# EAGLE schematic LED (EAGLE 9.5.2)
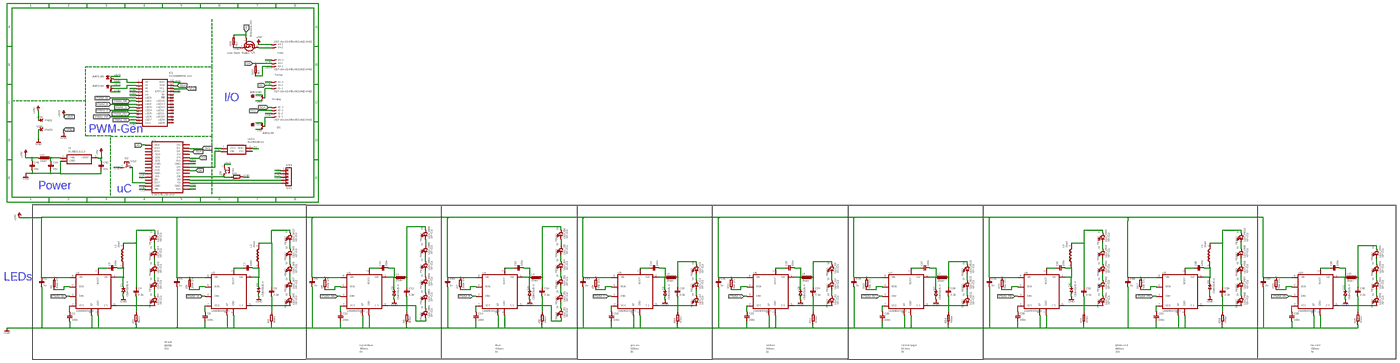
[diagram p0: schematic, sheet 1, overview]
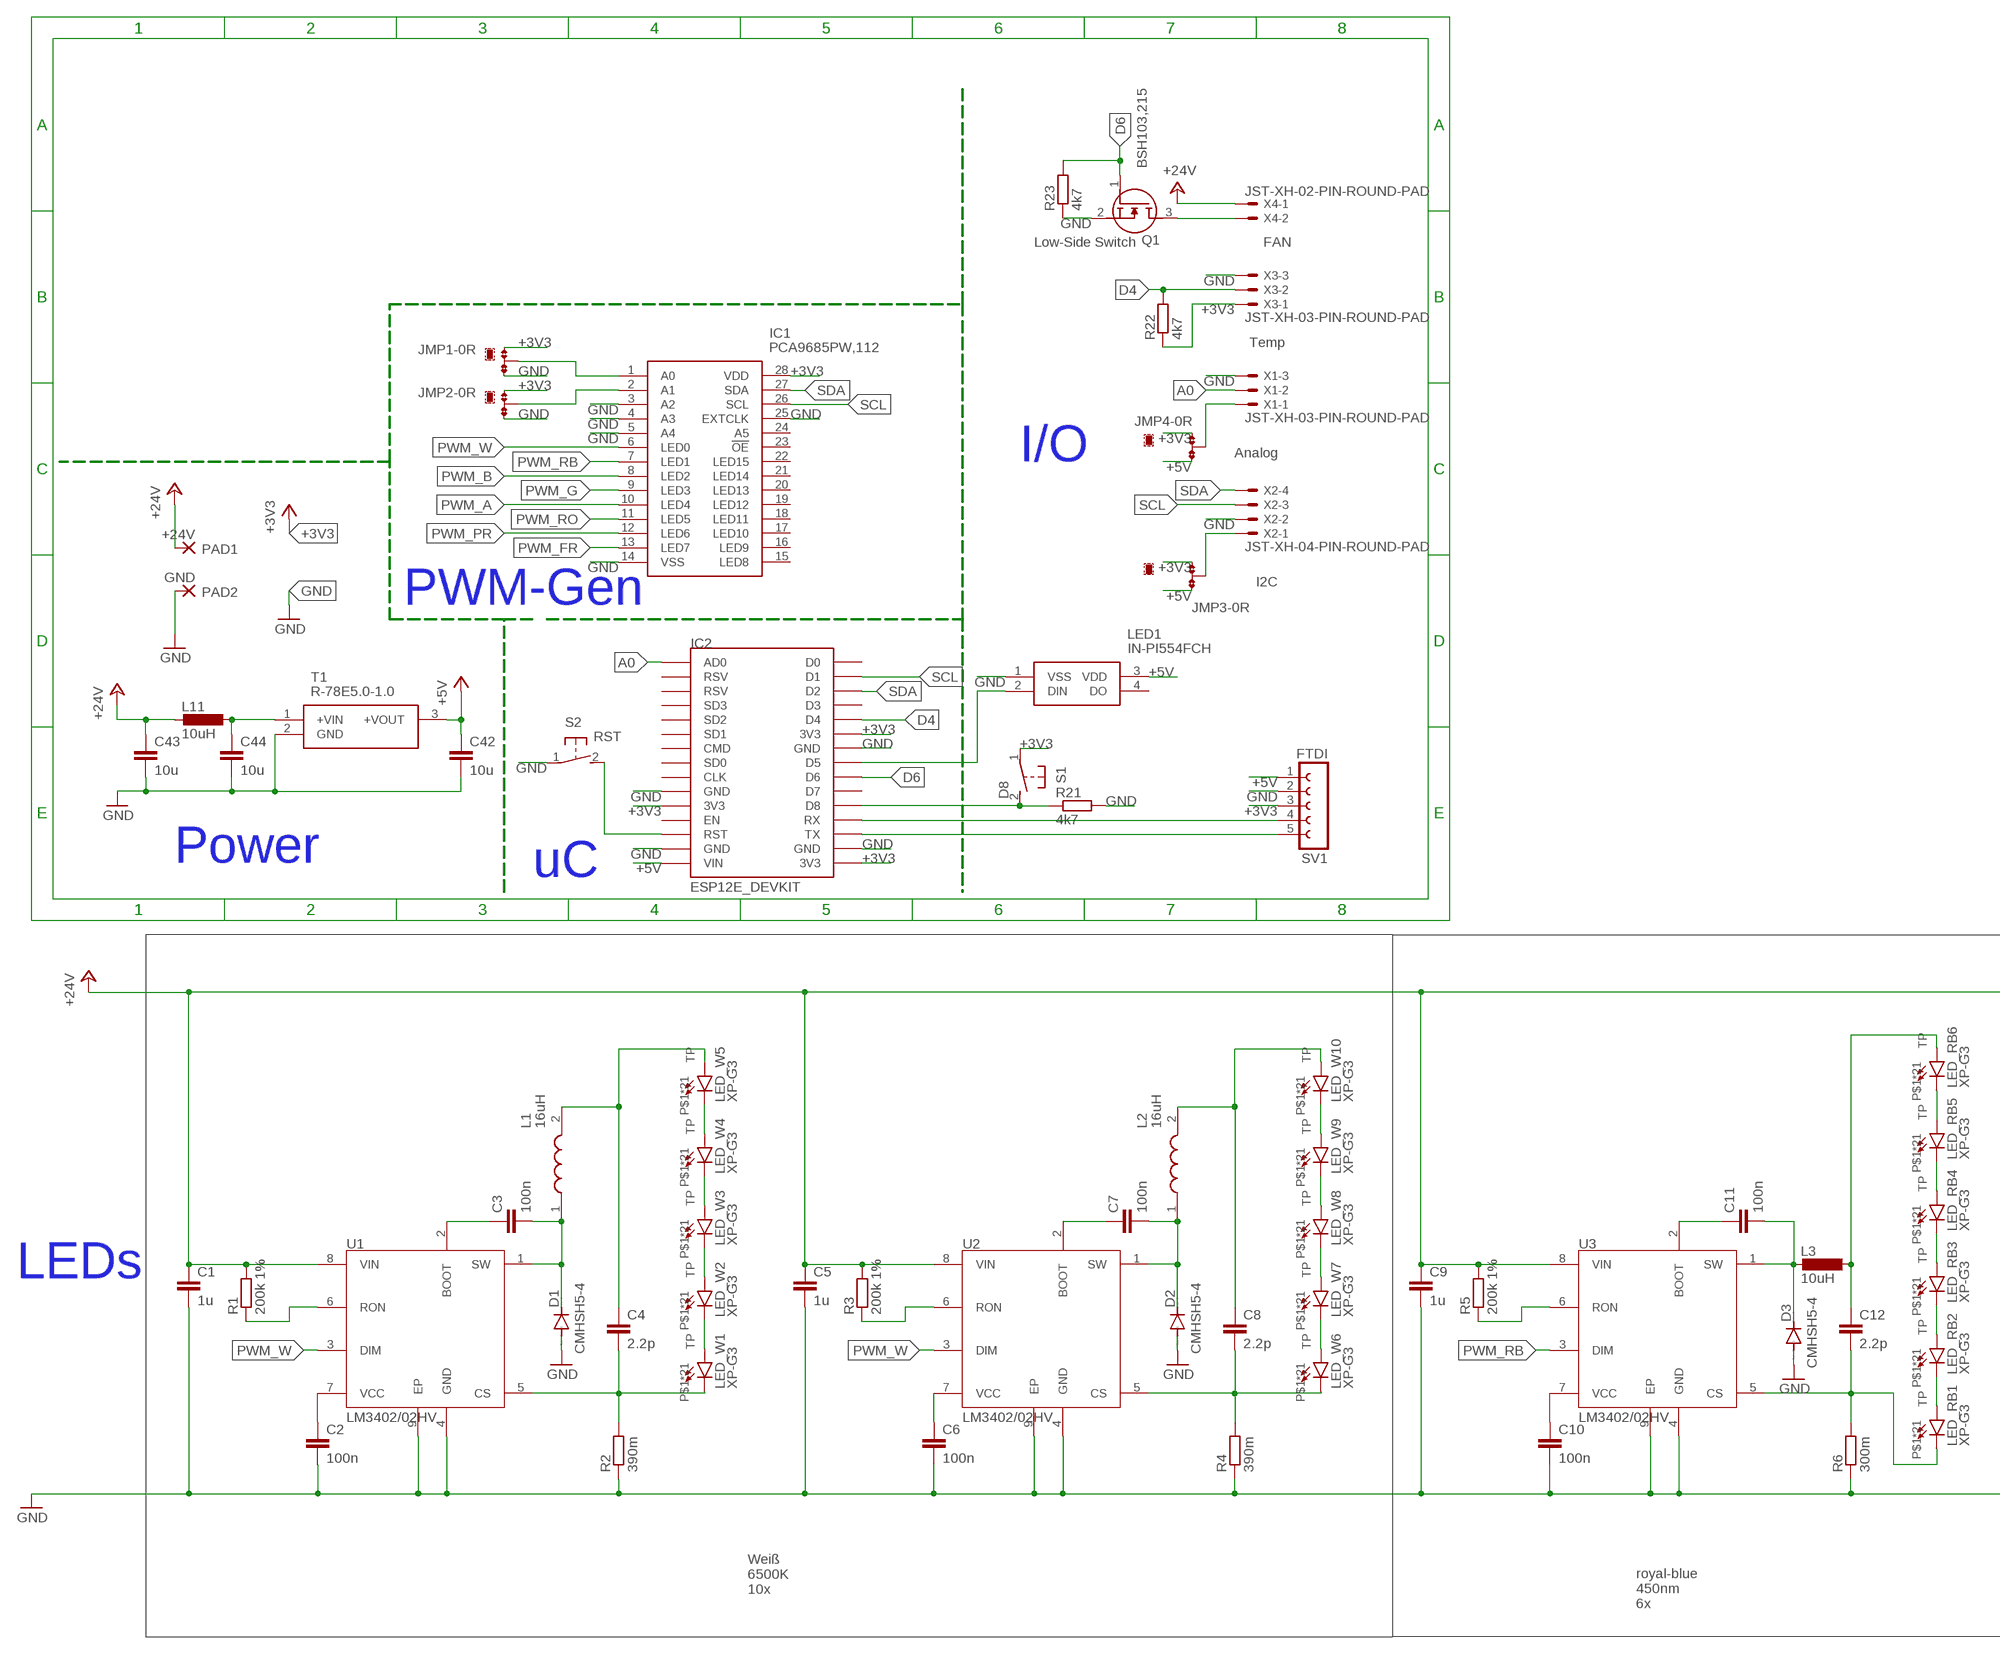
[diagram p1: schematic, sheet 1, part 1 of 4]
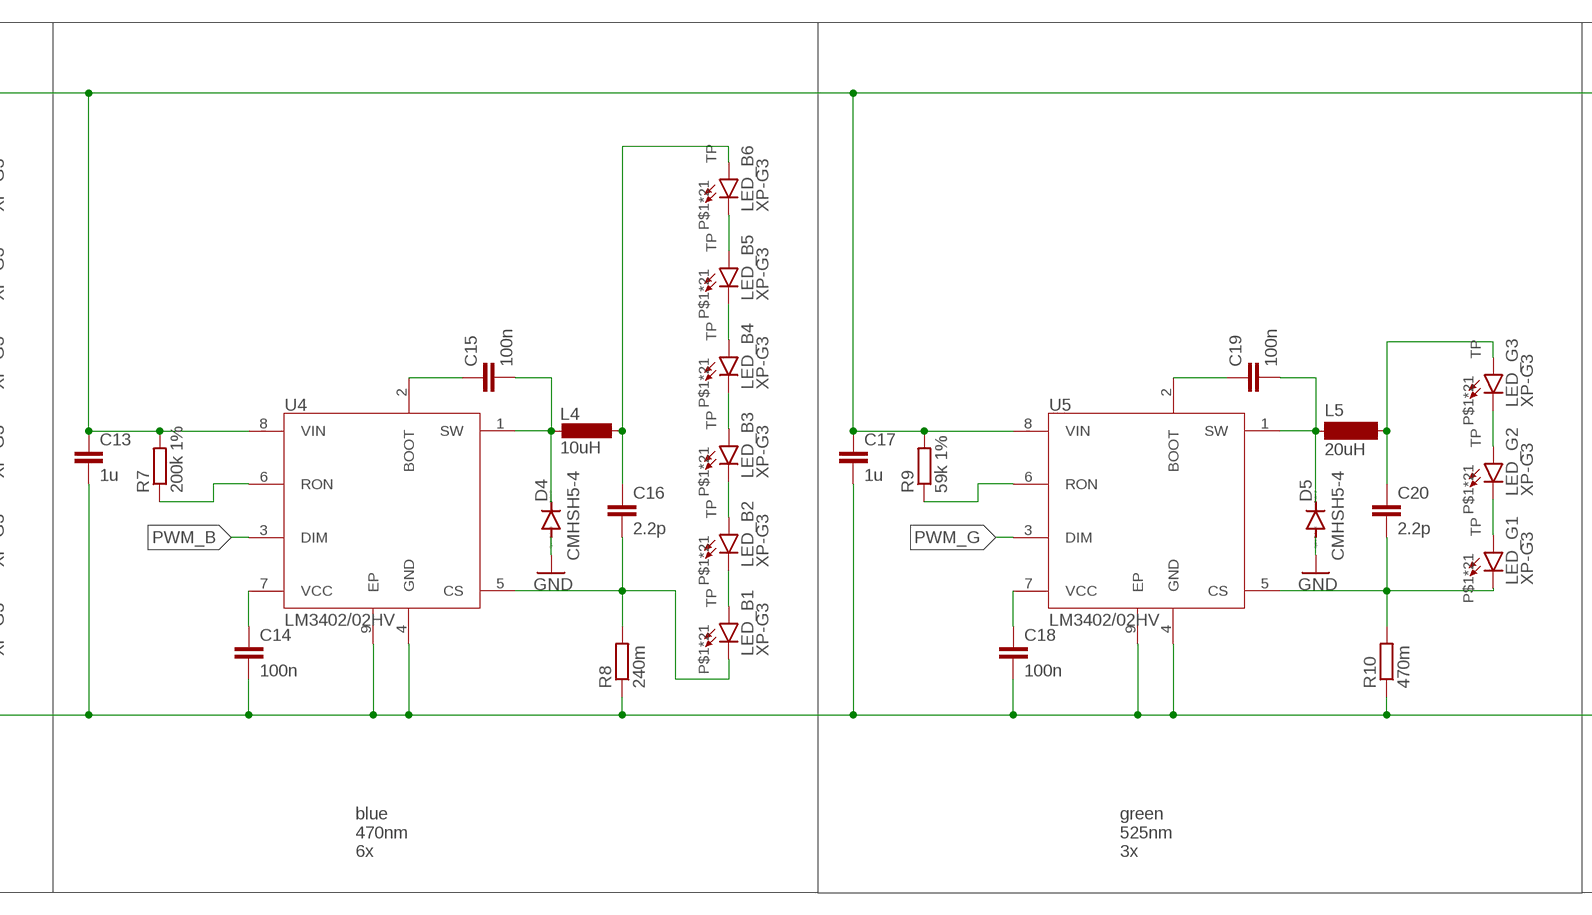
[diagram p2: schematic, sheet 1, part 2 of 4]
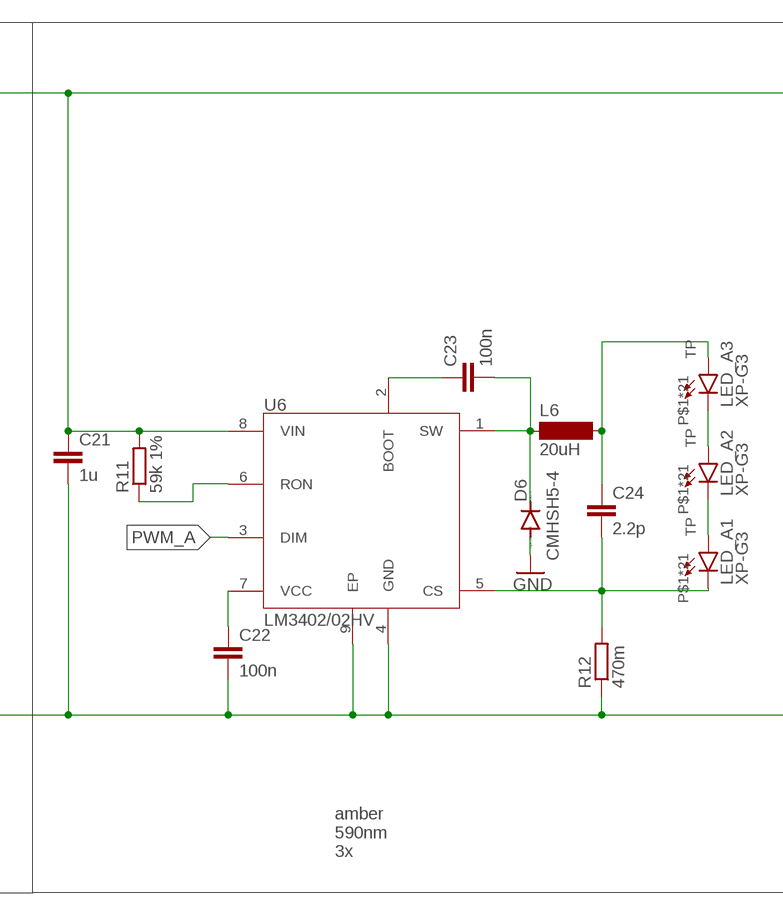
[diagram p3: schematic, sheet 1, part 3 of 4]
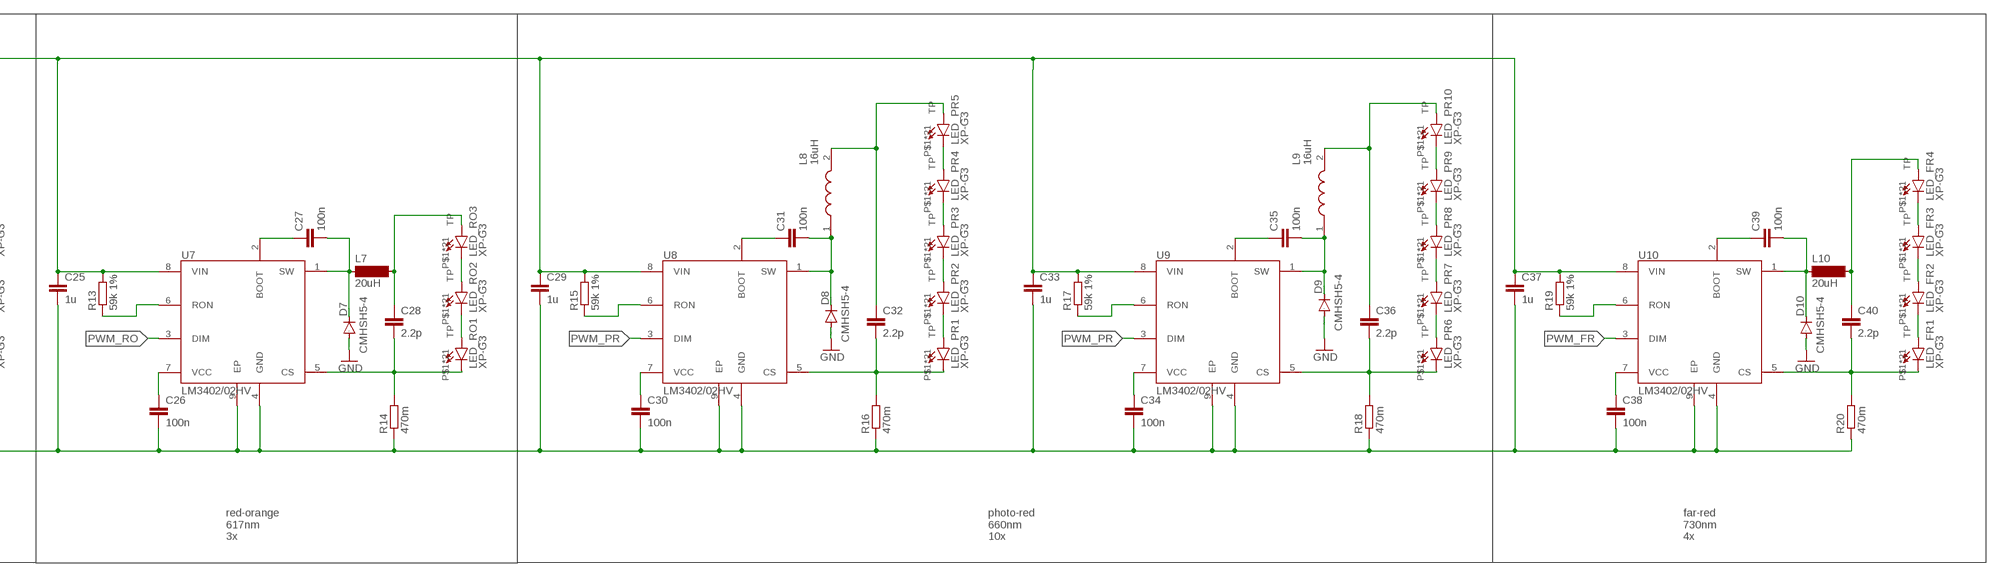
[diagram p4: schematic, sheet 1, part 4 of 4]

## Parts
C1  1u  C-EUC1206  [C1206]
C2  100n  C-EUC0805  [C0805]
C3  100n  C-EUC0805  [C0805]
C4  2.2p  C-EUC1206  [C1206]
C5  1u  C-EUC1206  [C1206]
C6  100n  C-EUC0805  [C0805]
C7  100n  C-EUC0805  [C0805]
C8  2.2p  C-EUC1206  [C1206]
C9  1u  C-EUC1206  [C1206]
C10  100n  C-EUC0805  [C0805]
C11  100n  C-EUC0805  [C0805]
C12  2.2p  C-EUC1206  [C1206]
C13  1u  C-EUC1206  [C1206]
C14  100n  C-EUC0805  [C0805]
C15  100n  C-EUC0805  [C0805]
C16  2.2p  C-EUC1206  [C1206]
C17  1u  C-EUC1206  [C1206]
C18  100n  C-EUC0805  [C0805]
C19  100n  C-EUC0805  [C0805]
C20  2.2p  C-EUC1206  [C1206]
C21  1u  C-EUC1206  [C1206]
C22  100n  C-EUC0805  [C0805]
C23  100n  C-EUC0805  [C0805]
C24  2.2p  C-EUC1206  [C1206]
C25  1u  C-EUC1206  [C1206]
C26  100n  C-EUC0805  [C0805]
C27  100n  C-EUC0805  [C0805]
C28  2.2p  C-EUC1206  [C1206]
C29  1u  C-EUC1206  [C1206]
C30  100n  C-EUC0805  [C0805]
C31  100n  C-EUC0805  [C0805]
C32  2.2p  C-EUC1206  [C1206]
C33  1u  C-EUC1206  [C1206]
C34  100n  C-EUC0805  [C0805]
C35  100n  C-EUC0805  [C0805]
C36  2.2p  C-EUC1206  [C1206]
C37  1u  C-EUC1206  [C1206]
C38  100n  C-EUC0805  [C0805]
C39  100n  C-EUC0805  [C0805]
C40  2.2p  C-EUC1206  [C1206]
C42  10u  C-EUC1210  [C1210]
C43  10u  C-EUC1210  [C1210]
C44  10u  C-EUC1210  [C1210]
D1  CMHSH5-4  MBR0520LT  [SOD123]
D2  CMHSH5-4  MBR0520LT  [SOD123]
D3  CMHSH5-4  MBR0520LT  [SOD123]
D4  CMHSH5-4  MBR0520LT  [SOD123]
D5  CMHSH5-4  MBR0520LT  [SOD123]
D6  CMHSH5-4  MBR0520LT  [SOD123]
D7  CMHSH5-4  MBR0520LT  [SOD123]
D8  CMHSH5-4  MBR0520LT  [SOD123]
D9  CMHSH5-4  MBR0520LT  [SOD123]
D10  CMHSH5-4  MBR0520LT  [SOD123]
IC1  PCA9685PW,112  [SOP65P640X110-28N]
IC2  ESP12E_DEVKIT  [ESP12E_DEVKIT]
JMP1  0R-JUMPA  [A0R-JMP]
JMP2  0R-JUMPA  [A0R-JMP]
JMP3  0R-JUMPA  [A0R-JMP]
JMP4  0R-JUMPA  [A0R-JMP]
L1  16uH  #B966AS-160M=P3  [INDPM101101X680N]
L2  16uH  #B966AS-160M=P3  [INDPM101101X680N]
L3  10uH  L-EUL3225M  [L3225M]
L4  10uH  L-EUL3225M  [L3225M]
L5  20uH  PF0382.223NLT  [PF0382.223NLT]
L6  20uH  PF0382.223NLT  [PF0382.223NLT]
L7  20uH  PF0382.223NLT  [PF0382.223NLT]
L8  16uH  #B966AS-160M=P3  [INDPM101101X680N]
L9  16uH  #B966AS-160M=P3  [INDPM101101X680N]
L10  20uH  PF0382.223NLT  [PF0382.223NLT]
L11  10uH  L-EUL3225M  [L3225M]
LED1  IN-PI554FCH  [INPI554FCH]
LED_A1  XP-G3  XPEWHT-L1-0000-00D01  [CREE_XLAMP]
LED_A2  XP-G3  XPEWHT-L1-0000-00D01  [CREE_XLAMP]
LED_A3  XP-G3  XPEWHT-L1-0000-00D01  [CREE_XLAMP]
LED_B1  XP-G3  XPEWHT-L1-0000-00D01  [CREE_XLAMP]
LED_B2  XP-G3  XPEWHT-L1-0000-00D01  [CREE_XLAMP]
LED_B3  XP-G3  XPEWHT-L1-0000-00D01  [CREE_XLAMP]
LED_B4  XP-G3  XPEWHT-L1-0000-00D01  [CREE_XLAMP]
LED_B5  XP-G3  XPEWHT-L1-0000-00D01  [CREE_XLAMP]
LED_B6  XP-G3  XPEWHT-L1-0000-00D01  [CREE_XLAMP]
LED_FR1  XP-G3  XPEWHT-L1-0000-00D01  [CREE_XLAMP]
LED_FR2  XP-G3  XPEWHT-L1-0000-00D01  [CREE_XLAMP]
LED_FR3  XP-G3  XPEWHT-L1-0000-00D01  [CREE_XLAMP]
LED_FR4  XP-G3  XPEWHT-L1-0000-00D01  [CREE_XLAMP]
LED_G1  XP-G3  XPEWHT-L1-0000-00D01  [CREE_XLAMP]
LED_G2  XP-G3  XPEWHT-L1-0000-00D01  [CREE_XLAMP]
LED_G3  XP-G3  XPEWHT-L1-0000-00D01  [CREE_XLAMP]
LED_PR1  XP-G3  XPEWHT-L1-0000-00D01  [CREE_XLAMP]
LED_PR2  XP-G3  XPEWHT-L1-0000-00D01  [CREE_XLAMP]
LED_PR3  XP-G3  XPEWHT-L1-0000-00D01  [CREE_XLAMP]
LED_PR4  XP-G3  XPEWHT-L1-0000-00D01  [CREE_XLAMP]
LED_PR5  XP-G3  XPEWHT-L1-0000-00D01  [CREE_XLAMP]
LED_PR6  XP-G3  XPEWHT-L1-0000-00D01  [CREE_XLAMP]
LED_PR7  XP-G3  XPEWHT-L1-0000-00D01  [CREE_XLAMP]
LED_PR8  XP-G3  XPEWHT-L1-0000-00D01  [CREE_XLAMP]
LED_PR9  XP-G3  XPEWHT-L1-0000-00D01  [CREE_XLAMP]
LED_PR10  XP-G3  XPEWHT-L1-0000-00D01  [CREE_XLAMP]
LED_RB1  XP-G3  XPEWHT-L1-0000-00D01  [CREE_XLAMP]
LED_RB2  XP-G3  XPEWHT-L1-0000-00D01  [CREE_XLAMP]
LED_RB3  XP-G3  XPEWHT-L1-0000-00D01  [CREE_XLAMP]
LED_RB4  XP-G3  XPEWHT-L1-0000-00D01  [CREE_XLAMP]
LED_RB5  XP-G3  XPEWHT-L1-0000-00D01  [CREE_XLAMP]
LED_RB6  XP-G3  XPEWHT-L1-0000-00D01  [CREE_XLAMP]
LED_RO1  XP-G3  XPEWHT-L1-0000-00D01  [CREE_XLAMP]
LED_RO2  XP-G3  XPEWHT-L1-0000-00D01  [CREE_XLAMP]
LED_RO3  XP-G3  XPEWHT-L1-0000-00D01  [CREE_XLAMP]
LED_W1  XP-G3  XPEWHT-L1-0000-00D01  [CREE_XLAMP]
LED_W2  XP-G3  XPEWHT-L1-0000-00D01  [CREE_XLAMP]
LED_W3  XP-G3  XPEWHT-L1-0000-00D01  [CREE_XLAMP]
LED_W4  XP-G3  XPEWHT-L1-0000-00D01  [CREE_XLAMP]
LED_W5  XP-G3  XPEWHT-L1-0000-00D01  [CREE_XLAMP]
LED_W6  XP-G3  XPEWHT-L1-0000-00D01  [CREE_XLAMP]
LED_W7  XP-G3  XPEWHT-L1-0000-00D01  [CREE_XLAMP]
LED_W8  XP-G3  XPEWHT-L1-0000-00D01  [CREE_XLAMP]
LED_W9  XP-G3  XPEWHT-L1-0000-00D01  [CREE_XLAMP]
LED_W10  XP-G3  XPEWHT-L1-0000-00D01  [CREE_XLAMP]
PAD1  +24V  3,81/1,4  [3,81/1,4]
PAD2  GND  3,81/1,4  [3,81/1,4]
Q1  BSH103,215  [SOT95P230X110-3N]
R1  200k 1%  R-EU_R0805  [R0805]
R2  390m  R-EU_R0805  [R0805]
R3  200k 1%  R-EU_R0805  [R0805]
R4  390m  R-EU_R0805  [R0805]
R5  200k 1%  R-EU_R0805  [R0805]
R6  300m  R-EU_R0805  [R0805]
R7  200k 1%  R-EU_R0805  [R0805]
R8  240m  R-EU_R0805  [R0805]
R9  59k 1%  R-EU_R0805  [R0805]
R10  470m  R-EU_R0805  [R0805]
R11  59k 1%  R-EU_R0805  [R0805]
R12  470m  R-EU_R0805  [R0805]
R13  59k 1%  R-EU_R0805  [R0805]
R14  470m  R-EU_R0805  [R0805]
R15  59k 1%  R-EU_R0805  [R0805]
R16  470m  R-EU_R0805  [R0805]
R17  59k 1%  R-EU_R0805  [R0805]
R18  470m  R-EU_R0805  [R0805]
R19  59k 1%  R-EU_R0805  [R0805]
R20  470m  R-EU_R0805  [R0805]
R21  4k7  R-EU_R0805  [R0805]
R22  4k7  R-EU_R0805  [R0805]
R23  4k7  R-EU_R0805  [R0805]
S1  D8  31-XX  [B3F-31XX]
S2  RST  31-XX  [B3F-31XX]
SV1  FTDI  FE05-1  [FE05-1]
T1  R-78E5.0-1.0  [R-78E5.0-1.0]
U1  LM3402/02HV  LM3402  [SOIC127P600X170-9T228N]
U2  LM3402/02HV  LM3402  [SOIC127P600X170-9T228N]
U3  LM3402/02HV  LM3402  [SOIC127P600X170-9T228N]
U4  LM3402/02HV  LM3402  [SOIC127P600X170-9T228N]
U5  LM3402/02HV  LM3402  [SOIC127P600X170-9T228N]
U6  LM3402/02HV  LM3402  [SOIC127P600X170-9T228N]
U7  LM3402/02HV  LM3402  [SOIC127P600X170-9T228N]
U8  LM3402/02HV  LM3402  [SOIC127P600X170-9T228N]
U9  LM3402/02HV  LM3402  [SOIC127P600X170-9T228N]
U10  LM3402/02HV  LM3402  [SOIC127P600X170-9T228N]
X1  JST-XH-03-PIN-ROUND-PAD  [JST-XH-03-PACKAGE-ROUND-PAD]
X2  JST-XH-04-PIN-ROUND-PAD  [JST-XH-04-PACKAGE-ROUND-PAD]
X3  JST-XH-03-PIN-ROUND-PAD  [JST-XH-03-PACKAGE-ROUND-PAD]
X4  JST-XH-02-PIN-ROUND-PAD  [JST-XH-02-PACKAGE-ROUND-PAD]

## Nets
+3V3 [1A]: IC1.28(VDD) IC2.3V3@0(3V3) IC2.3V3@1(3V3) IC2.3V3@2(3V3) JMP1.1 JMP2.1 JMP3.1 JMP4.1 R22.1 S1.1(P) SV1.3 X3.1
+5V [1A]: C42.1 IC2.VIN JMP3.3 JMP4.3 LED1.3(VDD) SV1.1 T1.3(+VOUT)
+24V [3A]: C1.1 C5.1 C9.1 C13.1 C17.1 C21.1 C25.1 C29.1 C33.1 C37.1 C43.1 L11.2 PAD1.1(P) R1.2 R3.2 R5.2 R7.2 R9.2 R11.2 R13.2 R15.2 R17.2 R19.2 U1.8(VIN) U2.8(VIN) U3.8(VIN) U4.8(VIN) U5.8(VIN) U6.8(VIN) U7.8(VIN) U8.8(VIN) U9.8(VIN) U10.8(VIN) X4.1
A0 [PWM]: IC2.AD0 X1.2
D4: IC2.D4 R22.2 X3.2
D6: IC2.D6 Q1.1(G) R23.2
GND: C1.2 C2.2 C5.2 C6.2 C9.2 C10.2 C13.2 C14.2 C17.2 C18.2 C21.2 C22.2 C25.2 C26.2 C29.2 C30.2 C33.2 C34.2 C37.2 C38.2 C42.2 C43.2 C44.2 D1.A D2.A D3.A D4.A D5.A D6.A D7.A D8.A D9.A D10.A IC1.3(A2) IC1.4(A3) IC1.5(A4) IC1.14(VSS) IC1.25(EXTCLK) IC2.GND@0(GND) IC2.GND@1(GND) IC2.GND@2(GND) IC2.GND@3(GND) JMP1.3 JMP2.3 LED1.1(VSS) PAD2.1(P) Q1.2(S) R2.1 R4.1 R6.1 R8.1 R10.1 R12.1 R14.1 R16.1 R18.1 R20.1 R21.2 R23.1 S2.1(P) SV1.2 T1.2(GND) U1.4(GND) U1.9(EP) U2.4(GND) U2.9(EP) U3.4(GND) U3.9(EP) U4.4(GND) U4.9(EP) U5.4(GND) U5.9(EP) U6.4(GND) U6.9(EP) U7.4(GND) U7.9(EP) U8.4(GND) U8.9(EP) U9.4(GND) U9.9(EP) U10.4(GND) U10.9(EP) X1.3 X2.2 X3.3
N$1: LED_W6.A LED_W6.A@1(A) LED_W7.C LED_W7.C@1(C)
N$2: LED_W7.A LED_W7.A@1(A) LED_W8.C LED_W8.C@1(C)
N$3: LED_W8.A LED_W8.A@1(A) LED_W9.C LED_W9.C@1(C)
N$4: LED_W9.A LED_W9.A@1(A) LED_W10.C LED_W10.C@1(C)
N$5: R3.1 U2.6(RON)
N$6: R1.1 U1.6(RON)
N$7: C3.1 U1.2(BOOT)
N$8: C3.2 D1.C L1.1 U1.1(SW)
N$9: C2.1 U1.7(VCC)
N$10: LED_W1.A LED_W1.A@1(A) LED_W2.C LED_W2.C@1(C)
N$11: LED_W2.A LED_W2.A@1(A) LED_W3.C LED_W3.C@1(C)
N$12: LED_W3.A LED_W3.A@1(A) LED_W4.C LED_W4.C@1(C)
N$13: LED_W4.A LED_W4.A@1(A) LED_W5.C LED_W5.C@1(C)
N$14: LED_RB5.A LED_RB5.A@1(A) LED_RB6.C LED_RB6.C@1(C)
N$15: C4.2 LED_W1.C LED_W1.C@1(C) R2.2 U1.5(CS)
N$16: C7.1 U2.2(BOOT)
N$17: C7.2 D2.C L2.1 U2.1(SW)
N$18: C6.1 U2.7(VCC)
N$19: LED_B1.A LED_B1.A@1(A) LED_B2.C LED_B2.C@1(C)
N$20: C8.1 L2.2 LED_W10.A LED_W10.A@1(A)
N$21: LED_B2.A LED_B2.A@1(A) LED_B3.C LED_B3.C@1(C)
N$22: LED_B3.A LED_B3.A@1(A) LED_B4.C LED_B4.C@1(C)
N$23: LED_B4.A LED_B4.A@1(A) LED_B5.C LED_B5.C@1(C)
N$24: LED_B5.A LED_B5.A@1(A) LED_B6.C LED_B6.C@1(C)
N$25: IC1.1(A0) JMP1.2
N$26: IC2.D8 R21.1 S1.2(S)
N$27: C8.2 LED_W6.C LED_W6.C@1(C) R4.2 U2.5(CS)
N$28: LED_RB1.A LED_RB1.A@1(A) LED_RB2.C LED_RB2.C@1(C)
N$29: LED_RB2.A LED_RB2.A@1(A) LED_RB3.C LED_RB3.C@1(C)
N$30: LED_RB3.A LED_RB3.A@1(A) LED_RB4.C LED_RB4.C@1(C)
N$31: LED_RB4.A LED_RB4.A@1(A) LED_RB5.C LED_RB5.C@1(C)
N$32: R5.1 U3.6(RON)
N$33: C11.1 U3.2(BOOT)
N$34: C11.2 D3.C L3.2 U3.1(SW)
N$35: C10.1 U3.7(VCC)
N$36: C12.1 L3.1 LED_RB6.A LED_RB6.A@1(A)
N$37: C12.2 LED_RB1.C LED_RB1.C@1(C) R6.2 U3.5(CS)
N$38: C44.1 L11.1 T1.1(+VIN)
N$39: IC1.2(A1) JMP2.2
N$40: JMP3.2 X2.1
N$41: IC2.RST S2.2(S)
N$42: JMP4.2 X1.1
N$43: IC2.D5 LED1.2(DIN)
N$44: IC2.RX SV1.4
N$45: IC2.TX SV1.5
N$46: Q1.3(D) X4.2
N$48: R7.1 U4.6(RON)
N$49: C15.1 U4.2(BOOT)
N$50: C15.2 D4.C L4.2 U4.1(SW)
N$51: C14.1 U4.7(VCC)
N$52: C16.1 L4.1 LED_B6.A LED_B6.A@1(A)
N$53: C16.2 LED_B1.C LED_B1.C@1(C) R8.2 U4.5(CS)
N$54: LED_G1.A LED_G1.A@1(A) LED_G2.C LED_G2.C@1(C)
N$61: LED_G2.A LED_G2.A@1(A) LED_G3.C LED_G3.C@1(C)
N$64: R9.1 U5.6(RON)
N$65: C19.1 U5.2(BOOT)
N$66: C19.2 D5.C L5.P0 U5.1(SW)
N$67: C18.1 U5.7(VCC)
N$68: C20.1 L5.P1 LED_G3.A LED_G3.A@1(A)
N$69: C20.2 LED_G1.C LED_G1.C@1(C) R10.2 U5.5(CS)
N$70: LED_A1.A LED_A1.A@1(A) LED_A2.C LED_A2.C@1(C)
N$71: LED_A2.A LED_A2.A@1(A) LED_A3.C LED_A3.C@1(C)
N$82: R11.1 U6.6(RON)
N$83: C23.1 U6.2(BOOT)
N$84: C23.2 D6.C L6.P0 U6.1(SW)
N$85: C22.1 U6.7(VCC)
N$86: C24.1 L6.P1 LED_A3.A LED_A3.A@1(A)
N$87: C24.2 LED_A1.C LED_A1.C@1(C) R12.2 U6.5(CS)
N$88: LED_RO1.A LED_RO1.A@1(A) LED_RO2.C LED_RO2.C@1(C)
N$89: LED_RO2.A LED_RO2.A@1(A) LED_RO3.C LED_RO3.C@1(C)
N$92: R13.1 U7.6(RON)
N$93: C27.1 U7.2(BOOT)
N$94: C27.2 D7.C L7.P0 U7.1(SW)
N$95: C26.1 U7.7(VCC)
N$96: C28.1 L7.P1 LED_RO3.A LED_RO3.A@1(A)
N$97: C28.2 LED_RO1.C LED_RO1.C@1(C) R14.2 U7.5(CS)
N$98: LED_PR1.A LED_PR1.A@1(A) LED_PR2.C LED_PR2.C@1(C)
N$99: LED_PR2.A LED_PR2.A@1(A) LED_PR3.C LED_PR3.C@1(C)
N$100: LED_PR3.A LED_PR3.A@1(A) LED_PR4.C LED_PR4.C@1(C)
N$101: LED_PR4.A LED_PR4.A@1(A) LED_PR5.C LED_PR5.C@1(C)
N$102: R15.1 U8.6(RON)
N$103: C31.1 U8.2(BOOT)
N$104: C31.2 D8.C L8.1 U8.1(SW)
N$105: C30.1 U8.7(VCC)
N$106: C32.1 L8.2 LED_PR5.A LED_PR5.A@1(A)
N$107: C32.2 LED_PR1.C LED_PR1.C@1(C) R16.2 U8.5(CS)
N$108: LED_PR6.A LED_PR6.A@1(A) LED_PR7.C LED_PR7.C@1(C)
N$109: LED_PR7.A LED_PR7.A@1(A) LED_PR8.C LED_PR8.C@1(C)
N$110: LED_PR8.A LED_PR8.A@1(A) LED_PR9.C LED_PR9.C@1(C)
N$111: LED_PR9.A LED_PR9.A@1(A) LED_PR10.C LED_PR10.C@1(C)
N$112: R17.1 U9.6(RON)
N$113: C35.1 U9.2(BOOT)
N$114: C35.2 D9.C L9.1 U9.1(SW)
N$115: C34.1 U9.7(VCC)
N$116: C36.1 L9.2 LED_PR10.A LED_PR10.A@1(A)
N$117: C36.2 LED_PR6.C LED_PR6.C@1(C) R18.2 U9.5(CS)
N$118: LED_FR1.A LED_FR1.A@1(A) LED_FR2.C LED_FR2.C@1(C)
N$119: LED_FR2.A LED_FR2.A@1(A) LED_FR3.C LED_FR3.C@1(C)
N$120: LED_FR3.A LED_FR3.A@1(A) LED_FR4.C LED_FR4.C@1(C)
N$122: R19.1 U10.6(RON)
N$123: C39.1 U10.2(BOOT)
N$124: C39.2 D10.C L10.P0 U10.1(SW)
N$125: C38.1 U10.7(VCC)
N$126: C40.1 L10.P1 LED_FR4.A LED_FR4.A@1(A)
N$127: C40.2 LED_FR1.C LED_FR1.C@1(C) R20.2 U10.5(CS)
N$129: C4.1 L1.2 LED_W5.A LED_W5.A@1(A)
PWM_A [PWM]: IC1.10(LED4) U6.3(DIM)
PWM_B [PWM]: IC1.8(LED2) U4.3(DIM)
PWM_FR [PWM]: IC1.13(LED7) U10.3(DIM)
PWM_G [PWM]: IC1.9(LED3) U5.3(DIM)
PWM_PR [PWM]: IC1.12(LED6) U8.3(DIM) U9.3(DIM)
PWM_RB [PWM]: IC1.7(LED1) U3.3(DIM)
PWM_RO [PWM]: IC1.11(LED5) U7.3(DIM)
PWM_W [PWM]: IC1.6(LED0) U1.3(DIM) U2.3(DIM)
SCL [PWM]: IC1.26(SCL) IC2.D1 X2.3
SDA [PWM]: IC1.27(SDA) IC2.D2 X2.4
Unconnected: IC1.15(LED8) IC1.16(LED9) IC1.17(LED10) IC1.18(LED11) IC1.19(LED12) IC1.20(LED13) IC1.21(LED14) IC1.22(LED15) IC1.23(!OE) IC1.24(A5) IC2.CLK IC2.CMD IC2.D0 IC2.D3 IC2.D7 IC2.EN IC2.RSV@0(RSV) IC2.RSV@1(RSV) IC2.SD0 IC2.SD1 IC2.SD2 IC2.SD3 LED1.4(DO) LED_A1.P$1(TP) LED_A1.P$2(TP) LED_A1.P$3(TP) LED_A1.P$4(TP) LED_A1.P$5(TP) LED_A1.P$6(TP) LED_A1.P$7(TP) LED_A1.P$8(TP) LED_A1.P$9(TP) LED_A1.P$10(TP) LED_A1.P$11(TP) LED_A1.P$12(TP) LED_A1.P$13(TP) LED_A1.P$14(TP) LED_A1.P$15(TP) LED_A1.P$16(TP) LED_A1.P$17(TP) LED_A1.P$18(TP) LED_A1.P$19(TP) LED_A1.P$20(TP) LED_A1.X(TP) LED_A2.P$1(TP) LED_A2.P$2(TP) LED_A2.P$3(TP) LED_A2.P$4(TP) LED_A2.P$5(TP) LED_A2.P$6(TP) LED_A2.P$7(TP) LED_A2.P$8(TP) LED_A2.P$9(TP) LED_A2.P$10(TP) LED_A2.P$11(TP) LED_A2.P$12(TP) LED_A2.P$13(TP) LED_A2.P$14(TP) LED_A2.P$15(TP) LED_A2.P$16(TP) LED_A2.P$17(TP) LED_A2.P$18(TP) LED_A2.P$19(TP) LED_A2.P$20(TP) LED_A2.X(TP) LED_A3.P$1(TP) LED_A3.P$2(TP) LED_A3.P$3(TP) LED_A3.P$4(TP) LED_A3.P$5(TP) LED_A3.P$6(TP) LED_A3.P$7(TP) LED_A3.P$8(TP) LED_A3.P$9(TP) LED_A3.P$10(TP) LED_A3.P$11(TP) LED_A3.P$12(TP) LED_A3.P$13(TP) LED_A3.P$14(TP) LED_A3.P$15(TP) LED_A3.P$16(TP) LED_A3.P$17(TP) LED_A3.P$18(TP) LED_A3.P$19(TP) LED_A3.P$20(TP) LED_A3.X(TP) LED_B1.P$1(TP) LED_B1.P$2(TP) LED_B1.P$3(TP) LED_B1.P$4(TP) LED_B1.P$5(TP) LED_B1.P$6(TP) LED_B1.P$7(TP) LED_B1.P$8(TP) LED_B1.P$9(TP) LED_B1.P$10(TP) LED_B1.P$11(TP) LED_B1.P$12(TP) LED_B1.P$13(TP) LED_B1.P$14(TP) LED_B1.P$15(TP) LED_B1.P$16(TP) LED_B1.P$17(TP) LED_B1.P$18(TP) LED_B1.P$19(TP) LED_B1.P$20(TP) LED_B1.X(TP) LED_B2.P$1(TP) LED_B2.P$2(TP) LED_B2.P$3(TP) LED_B2.P$4(TP) LED_B2.P$5(TP) LED_B2.P$6(TP) LED_B2.P$7(TP) LED_B2.P$8(TP) LED_B2.P$9(TP) LED_B2.P$10(TP) LED_B2.P$11(TP) LED_B2.P$12(TP) LED_B2.P$13(TP) LED_B2.P$14(TP) LED_B2.P$15(TP) LED_B2.P$16(TP) LED_B2.P$17(TP) LED_B2.P$18(TP) LED_B2.P$19(TP) LED_B2.P$20(TP) LED_B2.X(TP) LED_B3.P$1(TP) LED_B3.P$2(TP) LED_B3.P$3(TP) LED_B3.P$4(TP) LED_B3.P$5(TP) LED_B3.P$6(TP) LED_B3.P$7(TP) LED_B3.P$8(TP) LED_B3.P$9(TP) LED_B3.P$10(TP) LED_B3.P$11(TP) LED_B3.P$12(TP) LED_B3.P$13(TP) LED_B3.P$14(TP) LED_B3.P$15(TP) LED_B3.P$16(TP) LED_B3.P$17(TP) LED_B3.P$18(TP) LED_B3.P$19(TP) LED_B3.P$20(TP) LED_B3.X(TP) LED_B4.P$1(TP) LED_B4.P$2(TP) LED_B4.P$3(TP) LED_B4.P$4(TP) LED_B4.P$5(TP) LED_B4.P$6(TP) LED_B4.P$7(TP) LED_B4.P$8(TP) LED_B4.P$9(TP) LED_B4.P$10(TP) LED_B4.P$11(TP) LED_B4.P$12(TP) LED_B4.P$13(TP) LED_B4.P$14(TP) LED_B4.P$15(TP) LED_B4.P$16(TP) LED_B4.P$17(TP) LED_B4.P$18(TP) LED_B4.P$19(TP) LED_B4.P$20(TP) LED_B4.X(TP) LED_B5.P$1(TP) LED_B5.P$2(TP) LED_B5.P$3(TP) LED_B5.P$4(TP) LED_B5.P$5(TP) LED_B5.P$6(TP) LED_B5.P$7(TP) LED_B5.P$8(TP) LED_B5.P$9(TP) LED_B5.P$10(TP) LED_B5.P$11(TP) LED_B5.P$12(TP) LED_B5.P$13(TP) LED_B5.P$14(TP) LED_B5.P$15(TP) LED_B5.P$16(TP) LED_B5.P$17(TP) LED_B5.P$18(TP) LED_B5.P$19(TP) LED_B5.P$20(TP) LED_B5.X(TP) LED_B6.P$1(TP) LED_B6.P$2(TP) LED_B6.P$3(TP) LED_B6.P$4(TP) LED_B6.P$5(TP) LED_B6.P$6(TP) LED_B6.P$7(TP) LED_B6.P$8(TP) LED_B6.P$9(TP) LED_B6.P$10(TP) LED_B6.P$11(TP) LED_B6.P$12(TP) LED_B6.P$13(TP) LED_B6.P$14(TP) LED_B6.P$15(TP) LED_B6.P$16(TP) LED_B6.P$17(TP) LED_B6.P$18(TP) LED_B6.P$19(TP) LED_B6.P$20(TP) LED_B6.X(TP) LED_FR1.P$1(TP) LED_FR1.P$2(TP) LED_FR1.P$3(TP) LED_FR1.P$4(TP) LED_FR1.P$5(TP) LED_FR1.P$6(TP) LED_FR1.P$7(TP) LED_FR1.P$8(TP) LED_FR1.P$9(TP) LED_FR1.P$10(TP) LED_FR1.P$11(TP) LED_FR1.P$12(TP) LED_FR1.P$13(TP) LED_FR1.P$14(TP) LED_FR1.P$15(TP) LED_FR1.P$16(TP) LED_FR1.P$17(TP) LED_FR1.P$18(TP) LED_FR1.P$19(TP) LED_FR1.P$20(TP) LED_FR1.X(TP) LED_FR2.P$1(TP) LED_FR2.P$2(TP) LED_FR2.P$3(TP) LED_FR2.P$4(TP) LED_FR2.P$5(TP) LED_FR2.P$6(TP) LED_FR2.P$7(TP) LED_FR2.P$8(TP) LED_FR2.P$9(TP) LED_FR2.P$10(TP) LED_FR2.P$11(TP) LED_FR2.P$12(TP) LED_FR2.P$13(TP) LED_FR2.P$14(TP) LED_FR2.P$15(TP) LED_FR2.P$16(TP) LED_FR2.P$17(TP) LED_FR2.P$18(TP) LED_FR2.P$19(TP) LED_FR2.P$20(TP) LED_FR2.X(TP) LED_FR3.P$1(TP) LED_FR3.P$2(TP) LED_FR3.P$3(TP) LED_FR3.P$4(TP) LED_FR3.P$5(TP) LED_FR3.P$6(TP) LED_FR3.P$7(TP) LED_FR3.P$8(TP) LED_FR3.P$9(TP) LED_FR3.P$10(TP) LED_FR3.P$11(TP) LED_FR3.P$12(TP) LED_FR3.P$13(TP) LED_FR3.P$14(TP) LED_FR3.P$15(TP) LED_FR3.P$16(TP) LED_FR3.P$17(TP) LED_FR3.P$18(TP) LED_FR3.P$19(TP) LED_FR3.P$20(TP) LED_FR3.X(TP) LED_FR4.P$1(TP) LED_FR4.P$2(TP) LED_FR4.P$3(TP) LED_FR4.P$4(TP) LED_FR4.P$5(TP) LED_FR4.P$6(TP) LED_FR4.P$7(TP) LED_FR4.P$8(TP) LED_FR4.P$9(TP) LED_FR4.P$10(TP) LED_FR4.P$11(TP) LED_FR4.P$12(TP) LED_FR4.P$13(TP) LED_FR4.P$14(TP) LED_FR4.P$15(TP) LED_FR4.P$16(TP) LED_FR4.P$17(TP) LED_FR4.P$18(TP) LED_FR4.P$19(TP) LED_FR4.P$20(TP) LED_FR4.X(TP) LED_G1.P$1(TP) LED_G1.P$2(TP) LED_G1.P$3(TP) LED_G1.P$4(TP) LED_G1.P$5(TP) LED_G1.P$6(TP) LED_G1.P$7(TP) LED_G1.P$8(TP) LED_G1.P$9(TP) LED_G1.P$10(TP) LED_G1.P$11(TP) LED_G1.P$12(TP) LED_G1.P$13(TP) LED_G1.P$14(TP) LED_G1.P$15(TP) LED_G1.P$16(TP) LED_G1.P$17(TP) LED_G1.P$18(TP) LED_G1.P$19(TP) LED_G1.P$20(TP) LED_G1.X(TP) LED_G2.P$1(TP) LED_G2.P$2(TP) LED_G2.P$3(TP) LED_G2.P$4(TP) LED_G2.P$5(TP) LED_G2.P$6(TP) LED_G2.P$7(TP) LED_G2.P$8(TP) LED_G2.P$9(TP) LED_G2.P$10(TP) LED_G2.P$11(TP) LED_G2.P$12(TP) LED_G2.P$13(TP) LED_G2.P$14(TP) LED_G2.P$15(TP) LED_G2.P$16(TP) LED_G2.P$17(TP) LED_G2.P$18(TP) LED_G2.P$19(TP) LED_G2.P$20(TP) LED_G2.X(TP) LED_G3.P$1(TP) LED_G3.P$2(TP) LED_G3.P$3(TP) LED_G3.P$4(TP) LED_G3.P$5(TP) LED_G3.P$6(TP) LED_G3.P$7(TP) LED_G3.P$8(TP) LED_G3.P$9(TP) LED_G3.P$10(TP) LED_G3.P$11(TP) LED_G3.P$12(TP) LED_G3.P$13(TP) LED_G3.P$14(TP) LED_G3.P$15(TP) LED_G3.P$16(TP) LED_G3.P$17(TP) LED_G3.P$18(TP) LED_G3.P$19(TP) LED_G3.P$20(TP) LED_G3.X(TP) LED_PR1.P$1(TP) LED_PR1.P$2(TP) LED_PR1.P$3(TP) LED_PR1.P$4(TP) LED_PR1.P$5(TP) LED_PR1.P$6(TP) LED_PR1.P$7(TP) LED_PR1.P$8(TP) LED_PR1.P$9(TP) LED_PR1.P$10(TP) LED_PR1.P$11(TP) LED_PR1.P$12(TP) LED_PR1.P$13(TP) LED_PR1.P$14(TP) LED_PR1.P$15(TP) LED_PR1.P$16(TP) LED_PR1.P$17(TP) LED_PR1.P$18(TP) LED_PR1.P$19(TP) LED_PR1.P$20(TP) LED_PR1.X(TP) LED_PR2.P$1(TP) LED_PR2.P$2(TP) LED_PR2.P$3(TP) LED_PR2.P$4(TP) LED_PR2.P$5(TP) LED_PR2.P$6(TP) LED_PR2.P$7(TP) LED_PR2.P$8(TP) LED_PR2.P$9(TP) LED_PR2.P$10(TP) LED_PR2.P$11(TP) LED_PR2.P$12(TP) LED_PR2.P$13(TP) LED_PR2.P$14(TP) LED_PR2.P$15(TP) LED_PR2.P$16(TP) LED_PR2.P$17(TP) LED_PR2.P$18(TP) LED_PR2.P$19(TP) LED_PR2.P$20(TP) LED_PR2.X(TP) LED_PR3.P$1(TP) LED_PR3.P$2(TP) LED_PR3.P$3(TP) LED_PR3.P$4(TP) LED_PR3.P$5(TP) LED_PR3.P$6(TP) LED_PR3.P$7(TP) LED_PR3.P$8(TP) LED_PR3.P$9(TP) LED_PR3.P$10(TP) LED_PR3.P$11(TP) LED_PR3.P$12(TP) LED_PR3.P$13(TP) LED_PR3.P$14(TP) LED_PR3.P$15(TP) LED_PR3.P$16(TP) LED_PR3.P$17(TP) LED_PR3.P$18(TP) LED_PR3.P$19(TP) LED_PR3.P$20(TP) LED_PR3.X(TP) LED_PR4.P$1(TP) LED_PR4.P$2(TP) LED_PR4.P$3(TP) LED_PR4.P$4(TP) LED_PR4.P$5(TP) LED_PR4.P$6(TP) LED_PR4.P$7(TP) LED_PR4.P$8(TP) LED_PR4.P$9(TP) LED_PR4.P$10(TP) LED_PR4.P$11(TP) LED_PR4.P$12(TP) LED_PR4.P$13(TP) LED_PR4.P$14(TP) LED_PR4.P$15(TP) LED_PR4.P$16(TP) LED_PR4.P$17(TP) LED_PR4.P$18(TP) LED_PR4.P$19(TP) LED_PR4.P$20(TP) LED_PR4.X(TP) LED_PR5.P$1(TP) LED_PR5.P$2(TP) LED_PR5.P$3(TP) LED_PR5.P$4(TP) LED_PR5.P$5(TP) LED_PR5.P$6(TP) LED_PR5.P$7(TP) LED_PR5.P$8(TP) LED_PR5.P$9(TP) LED_PR5.P$10(TP) LED_PR5.P$11(TP) LED_PR5.P$12(TP) LED_PR5.P$13(TP) LED_PR5.P$14(TP) LED_PR5.P$15(TP) LED_PR5.P$16(TP) LED_PR5.P$17(TP) LED_PR5.P$18(TP) LED_PR5.P$19(TP) LED_PR5.P$20(TP) LED_PR5.X(TP) LED_PR6.P$1(TP) LED_PR6.P$2(TP) LED_PR6.P$3(TP) LED_PR6.P$4(TP) LED_PR6.P$5(TP) LED_PR6.P$6(TP) LED_PR6.P$7(TP) LED_PR6.P$8(TP) LED_PR6.P$9(TP) LED_PR6.P$10(TP) LED_PR6.P$11(TP) LED_PR6.P$12(TP) LED_PR6.P$13(TP) LED_PR6.P$14(TP) LED_PR6.P$15(TP) LED_PR6.P$16(TP) LED_PR6.P$17(TP) LED_PR6.P$18(TP) LED_PR6.P$19(TP) LED_PR6.P$20(TP) LED_PR6.X(TP) LED_PR7.P$1(TP) LED_PR7.P$2(TP) LED_PR7.P$3(TP) LED_PR7.P$4(TP) LED_PR7.P$5(TP) LED_PR7.P$6(TP) LED_PR7.P$7(TP) LED_PR7.P$8(TP) LED_PR7.P$9(TP) LED_PR7.P$10(TP) LED_PR7.P$11(TP) LED_PR7.P$12(TP) LED_PR7.P$13(TP) LED_PR7.P$14(TP) LED_PR7.P$15(TP) LED_PR7.P$16(TP) LED_PR7.P$17(TP) LED_PR7.P$18(TP) LED_PR7.P$19(TP) LED_PR7.P$20(TP) LED_PR7.X(TP) LED_PR8.P$1(TP) LED_PR8.P$2(TP) LED_PR8.P$3(TP) LED_PR8.P$4(TP) LED_PR8.P$5(TP) LED_PR8.P$6(TP) LED_PR8.P$7(TP) LED_PR8.P$8(TP) LED_PR8.P$9(TP) LED_PR8.P$10(TP) LED_PR8.P$11(TP) LED_PR8.P$12(TP) LED_PR8.P$13(TP) LED_PR8.P$14(TP) LED_PR8.P$15(TP) LED_PR8.P$16(TP) LED_PR8.P$17(TP) LED_PR8.P$18(TP) LED_PR8.P$19(TP) LED_PR8.P$20(TP) LED_PR8.X(TP) LED_PR9.P$1(TP) LED_PR9.P$2(TP) LED_PR9.P$3(TP) LED_PR9.P$4(TP) LED_PR9.P$5(TP) LED_PR9.P$6(TP) LED_PR9.P$7(TP) LED_PR9.P$8(TP) LED_PR9.P$9(TP) LED_PR9.P$10(TP) LED_PR9.P$11(TP) LED_PR9.P$12(TP) LED_PR9.P$13(TP) LED_PR9.P$14(TP) LED_PR9.P$15(TP) LED_PR9.P$16(TP) LED_PR9.P$17(TP) LED_PR9.P$18(TP) LED_PR9.P$19(TP) LED_PR9.P$20(TP) LED_PR9.X(TP) LED_PR10.P$1(TP) LED_PR10.P$2(TP) LED_PR10.P$3(TP) LED_PR10.P$4(TP) LED_PR10.P$5(TP) LED_PR10.P$6(TP) LED_PR10.P$7(TP) LED_PR10.P$8(TP) LED_PR10.P$9(TP) LED_PR10.P$10(TP) LED_PR10.P$11(TP) LED_PR10.P$12(TP) LED_PR10.P$13(TP) LED_PR10.P$14(TP) LED_PR10.P$15(TP) LED_PR10.P$16(TP) LED_PR10.P$17(TP) LED_PR10.P$18(TP) LED_PR10.P$19(TP) LED_PR10.P$20(TP) LED_PR10.X(TP) LED_RB1.P$1(TP) LED_RB1.P$2(TP) LED_RB1.P$3(TP) LED_RB1.P$4(TP) LED_RB1.P$5(TP) LED_RB1.P$6(TP) LED_RB1.P$7(TP) LED_RB1.P$8(TP) LED_RB1.P$9(TP) LED_RB1.P$10(TP) LED_RB1.P$11(TP) LED_RB1.P$12(TP) LED_RB1.P$13(TP) LED_RB1.P$14(TP) LED_RB1.P$15(TP) LED_RB1.P$16(TP) LED_RB1.P$17(TP) LED_RB1.P$18(TP) LED_RB1.P$19(TP) LED_RB1.P$20(TP) LED_RB1.X(TP) LED_RB2.P$1(TP) LED_RB2.P$2(TP) LED_RB2.P$3(TP) LED_RB2.P$4(TP) LED_RB2.P$5(TP) LED_RB2.P$6(TP) LED_RB2.P$7(TP) LED_RB2.P$8(TP) LED_RB2.P$9(TP) LED_RB2.P$10(TP) LED_RB2.P$11(TP) LED_RB2.P$12(TP) LED_RB2.P$13(TP) LED_RB2.P$14(TP) LED_RB2.P$15(TP) LED_RB2.P$16(TP) LED_RB2.P$17(TP) LED_RB2.P$18(TP) LED_RB2.P$19(TP) LED_RB2.P$20(TP) LED_RB2.X(TP) LED_RB3.P$1(TP) LED_RB3.P$2(TP) LED_RB3.P$3(TP) LED_RB3.P$4(TP) LED_RB3.P$5(TP) LED_RB3.P$6(TP) LED_RB3.P$7(TP) LED_RB3.P$8(TP) LED_RB3.P$9(TP) LED_RB3.P$10(TP) LED_RB3.P$11(TP) LED_RB3.P$12(TP) LED_RB3.P$13(TP) LED_RB3.P$14(TP) LED_RB3.P$15(TP) LED_RB3.P$16(TP) LED_RB3.P$17(TP) LED_RB3.P$18(TP) LED_RB3.P$19(TP) LED_RB3.P$20(TP) LED_RB3.X(TP) LED_RB4.P$1(TP) LED_RB4.P$2(TP) LED_RB4.P$3(TP) LED_RB4.P$4(TP) LED_RB4.P$5(TP) LED_RB4.P$6(TP) LED_RB4.P$7(TP) LED_RB4.P$8(TP) LED_RB4.P$9(TP) LED_RB4.P$10(TP) LED_RB4.P$11(TP) LED_RB4.P$12(TP) LED_RB4.P$13(TP) LED_RB4.P$14(TP) LED_RB4.P$15(TP) LED_RB4.P$16(TP) LED_RB4.P$17(TP) LED_RB4.P$18(TP) LED_RB4.P$19(TP) LED_RB4.P$20(TP) LED_RB4.X(TP) LED_RB5.P$1(TP) LED_RB5.P$2(TP) LED_RB5.P$3(TP) LED_RB5.P$4(TP) LED_RB5.P$5(TP) LED_RB5.P$6(TP) LED_RB5.P$7(TP) LED_RB5.P$8(TP) LED_RB5.P$9(TP) LED_RB5.P$10(TP) LED_RB5.P$11(TP) LED_RB5.P$12(TP) LED_RB5.P$13(TP) LED_RB5.P$14(TP) LED_RB5.P$15(TP) LED_RB5.P$16(TP) LED_RB5.P$17(TP) LED_RB5.P$18(TP) LED_RB5.P$19(TP) LED_RB5.P$20(TP) LED_RB5.X(TP) LED_RB6.P$1(TP) LED_RB6.P$2(TP) LED_RB6.P$3(TP) LED_RB6.P$4(TP) LED_RB6.P$5(TP) LED_RB6.P$6(TP) LED_RB6.P$7(TP) LED_RB6.P$8(TP) LED_RB6.P$9(TP) LED_RB6.P$10(TP) LED_RB6.P$11(TP) LED_RB6.P$12(TP) LED_RB6.P$13(TP) LED_RB6.P$14(TP) LED_RB6.P$15(TP) LED_RB6.P$16(TP) LED_RB6.P$17(TP) LED_RB6.P$18(TP) LED_RB6.P$19(TP) LED_RB6.P$20(TP) LED_RB6.X(TP) LED_RO1.P$1(TP) LED_RO1.P$2(TP) LED_RO1.P$3(TP) LED_RO1.P$4(TP) LED_RO1.P$5(TP) LED_RO1.P$6(TP) LED_RO1.P$7(TP) LED_RO1.P$8(TP) LED_RO1.P$9(TP) LED_RO1.P$10(TP) LED_RO1.P$11(TP) LED_RO1.P$12(TP) LED_RO1.P$13(TP) LED_RO1.P$14(TP) LED_RO1.P$15(TP) LED_RO1.P$16(TP) LED_RO1.P$17(TP) LED_RO1.P$18(TP) LED_RO1.P$19(TP) LED_RO1.P$20(TP) LED_RO1.X(TP) LED_RO2.P$1(TP) LED_RO2.P$2(TP) LED_RO2.P$3(TP) LED_RO2.P$4(TP) LED_RO2.P$5(TP) LED_RO2.P$6(TP) LED_RO2.P$7(TP) LED_RO2.P$8(TP) LED_RO2.P$9(TP) LED_RO2.P$10(TP) LED_RO2.P$11(TP) LED_RO2.P$12(TP) LED_RO2.P$13(TP) LED_RO2.P$14(TP) LED_RO2.P$15(TP) LED_RO2.P$16(TP) LED_RO2.P$17(TP) LED_RO2.P$18(TP) LED_RO2.P$19(TP) LED_RO2.P$20(TP) LED_RO2.X(TP) LED_RO3.P$1(TP) LED_RO3.P$2(TP) LED_RO3.P$3(TP) LED_RO3.P$4(TP) LED_RO3.P$5(TP) LED_RO3.P$6(TP) LED_RO3.P$7(TP) LED_RO3.P$8(TP) LED_RO3.P$9(TP) LED_RO3.P$10(TP) LED_RO3.P$11(TP) LED_RO3.P$12(TP) LED_RO3.P$13(TP) LED_RO3.P$14(TP) LED_RO3.P$15(TP) LED_RO3.P$16(TP) LED_RO3.P$17(TP) LED_RO3.P$18(TP) LED_RO3.P$19(TP) LED_RO3.P$20(TP) LED_RO3.X(TP) LED_W1.P$1(TP) LED_W1.P$2(TP) LED_W1.P$3(TP) LED_W1.P$4(TP) LED_W1.P$5(TP) LED_W1.P$6(TP) LED_W1.P$7(TP) LED_W1.P$8(TP) LED_W1.P$9(TP) LED_W1.P$10(TP) LED_W1.P$11(TP) LED_W1.P$12(TP) LED_W1.P$13(TP) LED_W1.P$14(TP) LED_W1.P$15(TP) LED_W1.P$16(TP) LED_W1.P$17(TP) LED_W1.P$18(TP) LED_W1.P$19(TP) LED_W1.P$20(TP) LED_W1.X(TP) LED_W2.P$1(TP) LED_W2.P$2(TP) LED_W2.P$3(TP) LED_W2.P$4(TP) LED_W2.P$5(TP) LED_W2.P$6(TP) LED_W2.P$7(TP) LED_W2.P$8(TP) LED_W2.P$9(TP) LED_W2.P$10(TP) LED_W2.P$11(TP) LED_W2.P$12(TP) LED_W2.P$13(TP) LED_W2.P$14(TP) LED_W2.P$15(TP) LED_W2.P$16(TP) LED_W2.P$17(TP) LED_W2.P$18(TP) LED_W2.P$19(TP) LED_W2.P$20(TP) LED_W2.X(TP) LED_W3.P$1(TP) LED_W3.P$2(TP) LED_W3.P$3(TP) LED_W3.P$4(TP) LED_W3.P$5(TP) LED_W3.P$6(TP) LED_W3.P$7(TP) LED_W3.P$8(TP) LED_W3.P$9(TP) LED_W3.P$10(TP) LED_W3.P$11(TP) LED_W3.P$12(TP) LED_W3.P$13(TP) LED_W3.P$14(TP) LED_W3.P$15(TP) LED_W3.P$16(TP) LED_W3.P$17(TP) LED_W3.P$18(TP) LED_W3.P$19(TP) LED_W3.P$20(TP) LED_W3.X(TP) LED_W4.P$1(TP) LED_W4.P$2(TP) LED_W4.P$3(TP) LED_W4.P$4(TP) LED_W4.P$5(TP) LED_W4.P$6(TP) LED_W4.P$7(TP) LED_W4.P$8(TP) LED_W4.P$9(TP) LED_W4.P$10(TP) LED_W4.P$11(TP) LED_W4.P$12(TP) LED_W4.P$13(TP) LED_W4.P$14(TP) LED_W4.P$15(TP) LED_W4.P$16(TP) LED_W4.P$17(TP) LED_W4.P$18(TP) LED_W4.P$19(TP) LED_W4.P$20(TP) LED_W4.X(TP) LED_W5.P$1(TP) LED_W5.P$2(TP) LED_W5.P$3(TP) LED_W5.P$4(TP) LED_W5.P$5(TP) LED_W5.P$6(TP) LED_W5.P$7(TP) LED_W5.P$8(TP) LED_W5.P$9(TP) LED_W5.P$10(TP) LED_W5.P$11(TP) LED_W5.P$12(TP) LED_W5.P$13(TP) LED_W5.P$14(TP) LED_W5.P$15(TP) LED_W5.P$16(TP) LED_W5.P$17(TP) LED_W5.P$18(TP) LED_W5.P$19(TP) LED_W5.P$20(TP) LED_W5.X(TP) LED_W6.P$1(TP) LED_W6.P$2(TP) LED_W6.P$3(TP) LED_W6.P$4(TP) LED_W6.P$5(TP) LED_W6.P$6(TP) LED_W6.P$7(TP) LED_W6.P$8(TP) LED_W6.P$9(TP) LED_W6.P$10(TP) LED_W6.P$11(TP) LED_W6.P$12(TP) LED_W6.P$13(TP) LED_W6.P$14(TP) LED_W6.P$15(TP) LED_W6.P$16(TP) LED_W6.P$17(TP) LED_W6.P$18(TP) LED_W6.P$19(TP) LED_W6.P$20(TP) LED_W6.X(TP) LED_W7.P$1(TP) LED_W7.P$2(TP) LED_W7.P$3(TP) LED_W7.P$4(TP) LED_W7.P$5(TP) LED_W7.P$6(TP) LED_W7.P$7(TP) LED_W7.P$8(TP) LED_W7.P$9(TP) LED_W7.P$10(TP) LED_W7.P$11(TP) LED_W7.P$12(TP) LED_W7.P$13(TP) LED_W7.P$14(TP) LED_W7.P$15(TP) LED_W7.P$16(TP) LED_W7.P$17(TP) LED_W7.P$18(TP) LED_W7.P$19(TP) LED_W7.P$20(TP) LED_W7.X(TP) LED_W8.P$1(TP) LED_W8.P$2(TP) LED_W8.P$3(TP) LED_W8.P$4(TP) LED_W8.P$5(TP) LED_W8.P$6(TP) LED_W8.P$7(TP) LED_W8.P$8(TP) LED_W8.P$9(TP) LED_W8.P$10(TP) LED_W8.P$11(TP) LED_W8.P$12(TP) LED_W8.P$13(TP) LED_W8.P$14(TP) LED_W8.P$15(TP) LED_W8.P$16(TP) LED_W8.P$17(TP) LED_W8.P$18(TP) LED_W8.P$19(TP) LED_W8.P$20(TP) LED_W8.X(TP) LED_W9.P$1(TP) LED_W9.P$2(TP) LED_W9.P$3(TP) LED_W9.P$4(TP) LED_W9.P$5(TP) LED_W9.P$6(TP) LED_W9.P$7(TP) LED_W9.P$8(TP) LED_W9.P$9(TP) LED_W9.P$10(TP) LED_W9.P$11(TP) LED_W9.P$12(TP) LED_W9.P$13(TP) LED_W9.P$14(TP) LED_W9.P$15(TP) LED_W9.P$16(TP) LED_W9.P$17(TP) LED_W9.P$18(TP) LED_W9.P$19(TP) LED_W9.P$20(TP) LED_W9.X(TP) LED_W10.P$1(TP) LED_W10.P$2(TP) LED_W10.P$3(TP) LED_W10.P$4(TP) LED_W10.P$5(TP) LED_W10.P$6(TP) LED_W10.P$7(TP) LED_W10.P$8(TP) LED_W10.P$9(TP) LED_W10.P$10(TP) LED_W10.P$11(TP) LED_W10.P$12(TP) LED_W10.P$13(TP) LED_W10.P$14(TP) LED_W10.P$15(TP) LED_W10.P$16(TP) LED_W10.P$17(TP) LED_W10.P$18(TP) LED_W10.P$19(TP) LED_W10.P$20(TP) LED_W10.X(TP)

## Notes on the sheet
- Low-Side Switch | FAN
- Temp
- Analog
- I/O
- I2C
- PWM-Gen
- Power | uC
- LEDs
- Weiß
  6500K
  10x
- royal-blue
  450nm
  6x
- blue
  470nm
  6x
- green
  525nm
  3x
- amber
  590nm
  3x
- red-orange
  617nm
  3x
- photo-red
  660nm
  10x
- far-red
  730nm
  4x

## Library data of the parts
C1-C40 C42-C44 = rcl:C-EU: CAPACITOR, European symbol; SPICEPREFIX: C
D1-D10 = diode:MBR0520LT: SCHOTTKY BARRIER RECTIFIER Source: http://onsemi.com .. MBR0520LT1-D.pdf
IC1 = SamacSys_Parts:PCA9685PW,112: 16-channel, 12-bit PWM Fm+ I2C-bus LED controller Source: Datasheet <https://componentsearchengine.com/Datasheets/1/PCA9685PW,112.pdf>; DESCRIPTION: 16-channel, 12-bit PWM Fm+ I2C-bus LED controller; HEIGHT: 1.1mm; MANUFACTURER_NAME: Nexperia; MANUFACTURER_PART_NUMBER: PCA9685PW,112; MOUSER_PART_NUMBER: 771-PCA9685PW,112; MOUSER_PRICE-STOCK: https://www.mouser.com/Search/Refine.aspx?Keyword=771-PCA9685PW%2C112
IC2 = ESP12E_DEVKIT:ESP12E_DEVKIT: ESP12E DEVKIT BOARD
JMP1-JMP4 = jump-0r-smd:0R-JUMP: SMD 0R 0805 Jumper
L1 L2 L8 L9 = SamacSys_Parts:#B966AS-160M=P3: DS106C2 Series Inductor 16uH +/-20% 4040 (101101) Source: Datasheet <https://psearch.en.murata.com/inductor/product/#B966AS-160M=P3.html>; DESCRIPTION: DS106C2 Series Inductor 16uH +/-20% 4040 (101101); HEIGHT: 6.8mm; MANUFACTURER_NAME: Murata Electronics; MANUFACTURER_PART_NUMBER: #B966AS-160M=P3; MOUSER_PART_NUMBER: 81-B966AS-160MP3; MOUSER_PRICE-STOCK: https://www.mouser.com/Search/Refine.aspx?Keyword=81-B966AS-160MP3
L3 L4 L11 = rcl:L-EU: INDUCTOR, European symbol; SPICEPREFIX: L
L5-L7 L10 = PF0382.223NLT:PF0382.223NLT
LED1 = SamacSys_Parts:IN-PI554FCH: Standard LEDs - SMD RGB Digital LED Source: Datasheet <https://componentsearchengine.com/Datasheets/1/IN-PI554FCH.pdf>; DESCRIPTION: Standard LEDs - SMD RGB Digital LED; HEIGHT: 1.6mm; MANUFACTURER_NAME: Inolux; MANUFACTURER_PART_NUMBER: IN-PI554FCH; MOUSER_PART_NUMBER: 743-IN-PI554FCH; MOUSER_PRICE-STOCK: https://www.mouser.com/Search/Refine.aspx?Keyword=743-IN-PI554FCH
LED_A1-LED_A3 LED_B1-LED_B6 LED_FR1-LED_FR4 LED_G1-LED_G3 LED_PR1-LED_PR10 LED_RB1-LED_RB6 LED_RO1-LED_RO3 LED_W1-LED_W10 = led:XPEWHT-: Cree® XLamp® XP-E LEDs Source: www.cree.com/xlamp .. XLampXP-E.pdf
PAD1 PAD2 = wirepad:3,81/1,4: THROUGH-HOLE PAD
Q1 = SamacSys_Parts:BSH103,215: MOSFET N-Channel 30V 0.85A TO236AB NXP BSH103,215 N-channel MOSFET Transistor, 0.85 A, 30 V, 3-Pin TO-236AB Source: Datasheet <https://componentsearchengine.com/Datasheets/1/BSH103,215.pdf>; DESCRIPTION: MOSFET N-Channel 30V 0.85A TO236AB NXP BSH103,215 N-channel MOSFET Transistor, 0.85 A, 30 V, 3-Pin TO-236AB; HEIGHT: 1.1mm; MANUFACTURER_NAME: Nexperia; MANUFACTURER_PART_NUMBER: BSH103,215; MOUSER_PART_NUMBER: 771-BSH103-T/R; MOUSER_PRICE-STOCK: https://www.mouser.com/Search/Refine.aspx?Keyword=771-BSH103-T%2FR
R1-R23 = rcl:R-EU_: RESISTOR, European symbol; SPICEPREFIX: R
S1 S2 = switch-omron:31-XX: OMRON SWITCH; MPN: B3F-3100; OC_FARNELL: 959704; OC_NEWARK: 36M3582
SV1 = con-lsta:FE05-1: FEMALE HEADER; OC_FARNELL: unknown; OC_NEWARK: unknown
T1 = SamacSys_Parts:R-78E5.0-1.0: Non-Isolated DC/DC Converters 8-28Vin 5V 1.0A THRU Source: Datasheet <https://componentsearchengine.com/Datasheets/1/R-78E5.0-1.0.pdf>; DESCRIPTION: Non-Isolated DC/DC Converters 8-28Vin 5V 1.0A THRU; HEIGHT: mm; MANUFACTURER_NAME: RECOM Power; MANUFACTURER_PART_NUMBER: R-78E5.0-1.0; MOUSER_PART_NUMBER: 919-R-78E5.0-1.0; MOUSER_PRICE-STOCK: https://www.mouser.com/Search/Refine.aspx?Keyword=919-R-78E5.0-1.0
U1-U10 = LM3402:LM3402
X1 X3 = Rembrandt Electronics - JST XH Connectors v1-0:JST-XH-03-PIN: JST XH Connector 2 Pin Wire to board connector. Pitch: 2,54 mm, (0.100") Number of pins: 3 Created by Rembrandt Electronics www.rembrandtelectronics.com
X2 = Rembrandt Electronics - JST XH Connectors v1-0:JST-XH-04-PIN: JST XH Connector 2 Pin Wire to board connector. Pitch: 2,54 mm, (0.100") Number of pins: 4 Created by Rembrandt Electronics www.rembrandtelectronics.com
X4 = Rembrandt Electronics - JST XH Connectors v1-0:JST-XH-02-PIN: JST XH Connector 2 Pin Wire to board connector. Pitch: 2,54 mm, (0.100") Number of pins: 2 Created by Rembrandt Electronics www.rembrandtelectronics.com

## Module AL1782T16E-13
Ports: 

### Library data of the parts

## Net classes
0 min: width 0.178 mm, drill 0.4 mm, clearance 0.178 mm
1 1A: width 0.305 mm, drill 0.6 mm, clearance 0.178 mm to class 0, clearance 0.178 mm
2 2A: width 0.762 mm, drill 0.8 mm, clearance 0.178 mm to class 0, clearance 0.178 mm to class 1, clearance 0.178 mm
3 PWM: width 0.178 mm, drill 0.4 mm, clearance 0.178 mm to class 0, clearance 0.178 mm to class 1, clearance 0.178 mm to class 2, clearance 0.178 mm
4 3A: width 1.346 mm, drill 0.8 mm, clearance 0.178 mm to class 0, clearance 0.178 mm to class 1, clearance 0.178 mm to class 2, clearance 0.178 mm to class 3, clearance 0.178 mm